# Altium schematic sheet AnalogFrontend.SchDoc
size A4; SheetNumber: 10; SheetTotal: 10
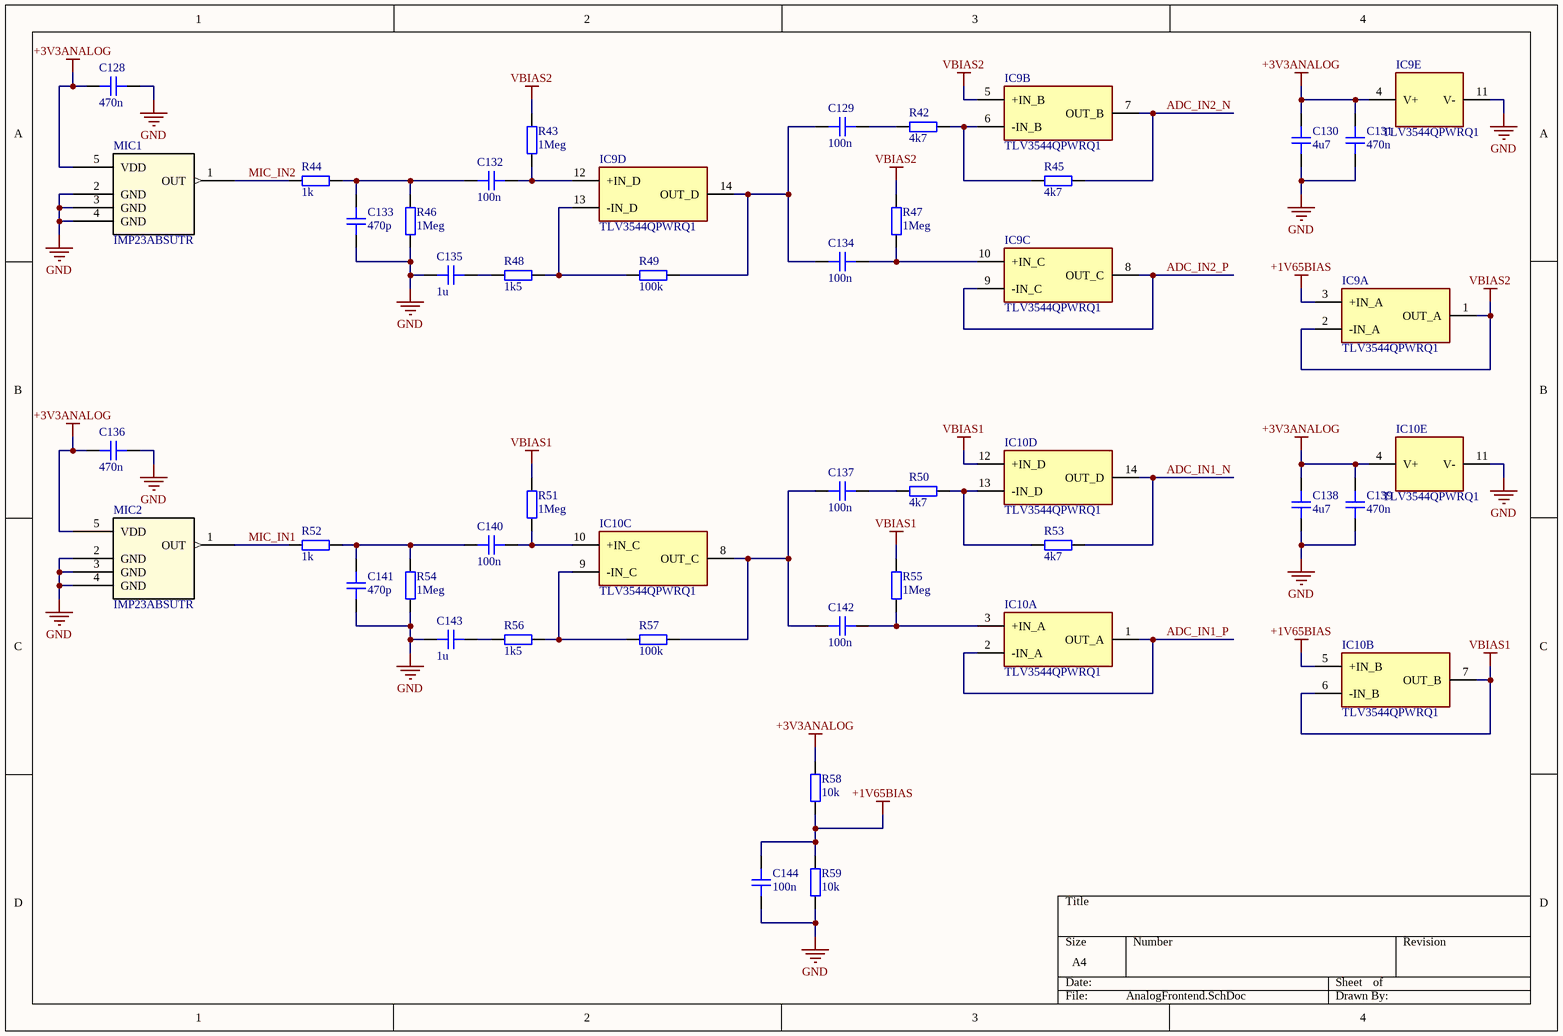
[diagram p0: AnalogFrontend.SchDoc]

## Parts
C128  470n  [CAP_0201]
C129  100n  [CAP_0402]
C130  4u7  [CAP_0402]
C131  470n  [CAP_0201]
C132  100n  [CAP_0402]
C133  470p  [CAP_0402]
C134  100n  [CAP_0402]
C135  1u  [CAP_0402]
C136  470n  [CAP_0201]
C137  100n  [CAP_0402]
C138  4u7  [CAP_0402]
C139  470n  [CAP_0201]
C140  100n  [CAP_0402]
C141  470p  [CAP_0402]
C142  100n  [CAP_0402]
C143  1u  [CAP_0402]
C144  100n  [CAP_0402]
IC9  TLV3544QPWRQ1  [SOP65P640X120-14N]  (parts A,B,C,D,E of 5)
IC10  TLV3544QPWRQ1  [SOP65P640X120-14N]  (parts A,B,C,D,E of 5)
MIC1  IMP23ABSUTR  [RHLGA5_3P5X2P65X0P98_STM]
MIC2  IMP23ABSUTR  [RHLGA5_3P5X2P65X0P98_STM]
R42  4k7  [RES_0402]
R43  1Meg  [RES_0402]
R44  1k  [RES_0402]
R45  4k7  [RES_0402]
R46  1Meg  [RES_0402]
R47  1Meg  [RES_0402]
R48  1k5  [RES_0402]
R49  100k  [RES_0402]
R50  4k7  [RES_0402]
R51  1Meg  [RES_0402]
R52  1k  [RES_0402]
R53  4k7  [RES_0402]
R54  1Meg  [RES_0402]
R55  1Meg  [RES_0402]
R56  1k5  [RES_0402]
R57  100k  [RES_0402]
R58  10k  [RES_0402]
R59  10k  [RES_0402]

## Nets
+1V65BIAS: C144.1 IC9.3(+IN_A) IC10.5(+IN_B) R58.1 R59.2
+3V3ANALOG: C128.2 C130.2 C131.2 C136.2 C138.2 C139.2 IC9.4(V+) IC10.4(V+) MIC1.5(VDD) MIC2.5(VDD) R58.2
GND: C128.1 C130.1 C131.1 C133.2 C135.1 C136.1 C138.1 C139.1 C141.2 C143.1 C144.2 IC9.11(V-) IC10.11(V-) MIC1.2(GND) MIC1.3(GND) MIC1.4(GND) MIC2.2(GND) MIC2.3(GND) MIC2.4(GND) R46.1 R54.1 R59.1
VBIAS1: IC10.6(-IN_B) IC10.7(OUT_B) IC10.12(+IN_D) R51.2 R55.2
VBIAS2: IC9.1(OUT_A) IC9.2(-IN_A) IC9.5(+IN_B) R43.2 R47.2
ADC_IN1_N: IC10.14(OUT_D) R53.2
ADC_IN1_P: IC10.1(OUT_A) IC10.2(-IN_A)
ADC_IN2_N: IC9.7(OUT_B) R45.2
ADC_IN2_P: IC9.8(OUT_C) IC9.9(-IN_C)
MIC_IN1: MIC2.1(OUT) R52.2
MIC_IN2: MIC1.1(OUT) R44.2
NetC129_1: C129.1 R42.1
NetC129_2: C129.2 C134.2 IC9.14(OUT_D) R49.2
NetC132_1: C132.1 IC9.12(+IN_D) R43.1
NetC132_2: C132.2 C133.1 R44.1 R46.2
NetC134_1: C134.1 IC9.10(+IN_C) R47.1
NetC135_2: C135.2 R48.1
NetC137_1: C137.1 R50.1
NetC137_2: C137.2 C142.2 IC10.8(OUT_C) R57.2
NetC140_1: C140.1 IC10.10(+IN_C) R51.1
NetC140_2: C140.2 C141.1 R52.1 R54.2
NetC142_1: C142.1 IC10.3(+IN_A) R55.1
NetC143_2: C143.2 R56.1
NetIC9_6: IC9.6(-IN_B) R42.2 R45.1
NetIC9_13: IC9.13(-IN_D) R48.2 R49.1
NetIC10_9: IC10.9(-IN_C) R56.2 R57.1
NetIC10_13: IC10.13(-IN_D) R50.2 R53.1

## Library data of the parts
C128 C131 C136 C139 = CAP_0201: Capacitor SMD 0201; Manufacturer: *; Manufacturer Part Number: *; Distributor Link: *; LCSC: *; Rating: *; Dielectric: *
C129 C130 C132-C135 C137 C138 C140-C144 = CAP_0402: Capacitor SMD 0402; Manufacturer: *; Manufacturer Part Number: *; Distributor Link: *; LCSC: *; Rating: *; Dielectric: *
IC9 IC10 = TLV3544QPWRQ1: Integrated Circuit; Manufacturer_Name: Texas Instruments; Datasheet Link: http://www.ti.com/lit/gpn/tlv3544-q1; Height: 1.2mm; Manufacturer_Part_Number: TLV3544QPWRQ1; Mouser Part Number: 595-TLV3544QPWRQ1; Mouser Price/Stock: https://www.mouser.co.uk/ProductDetail/Texas-Instruments/TLV3544QPWRQ1?qs=xhbEVWpZdWeZ7jRiLWDiEw%3D%3D; Arrow Part Number: TLV3544QPWRQ1; Arrow Price/Stock: https://www.arrow.com/en/products/tlv3544qpwrq1/texas-instruments?utm_currency=USD&region=nac
MIC1 MIC2 = IMP23ABSUTR: No Description Available; Mfr_Name: STMicroelectronics; RefDes: RefDes; Type: Type
R42-R59 = RES_0402: Resistor SMD 0402; Manufacturer: *; Manufacturer Part Number: *; Distributor Link: *; LCSC: *